# Altium schematic sheet hmi.SchDoc
size 594 x 420 mm; Address1: Address1; Address2: Address2; Address3: Address3; Address4: Address4; DocumentNumber: АБВГ.123456.001 Э3; SheetNumber: 1; Scale: 1:1; DocumentType: Схема электрическая принципиальная; FirstReferrence: АБВГ.123456.001
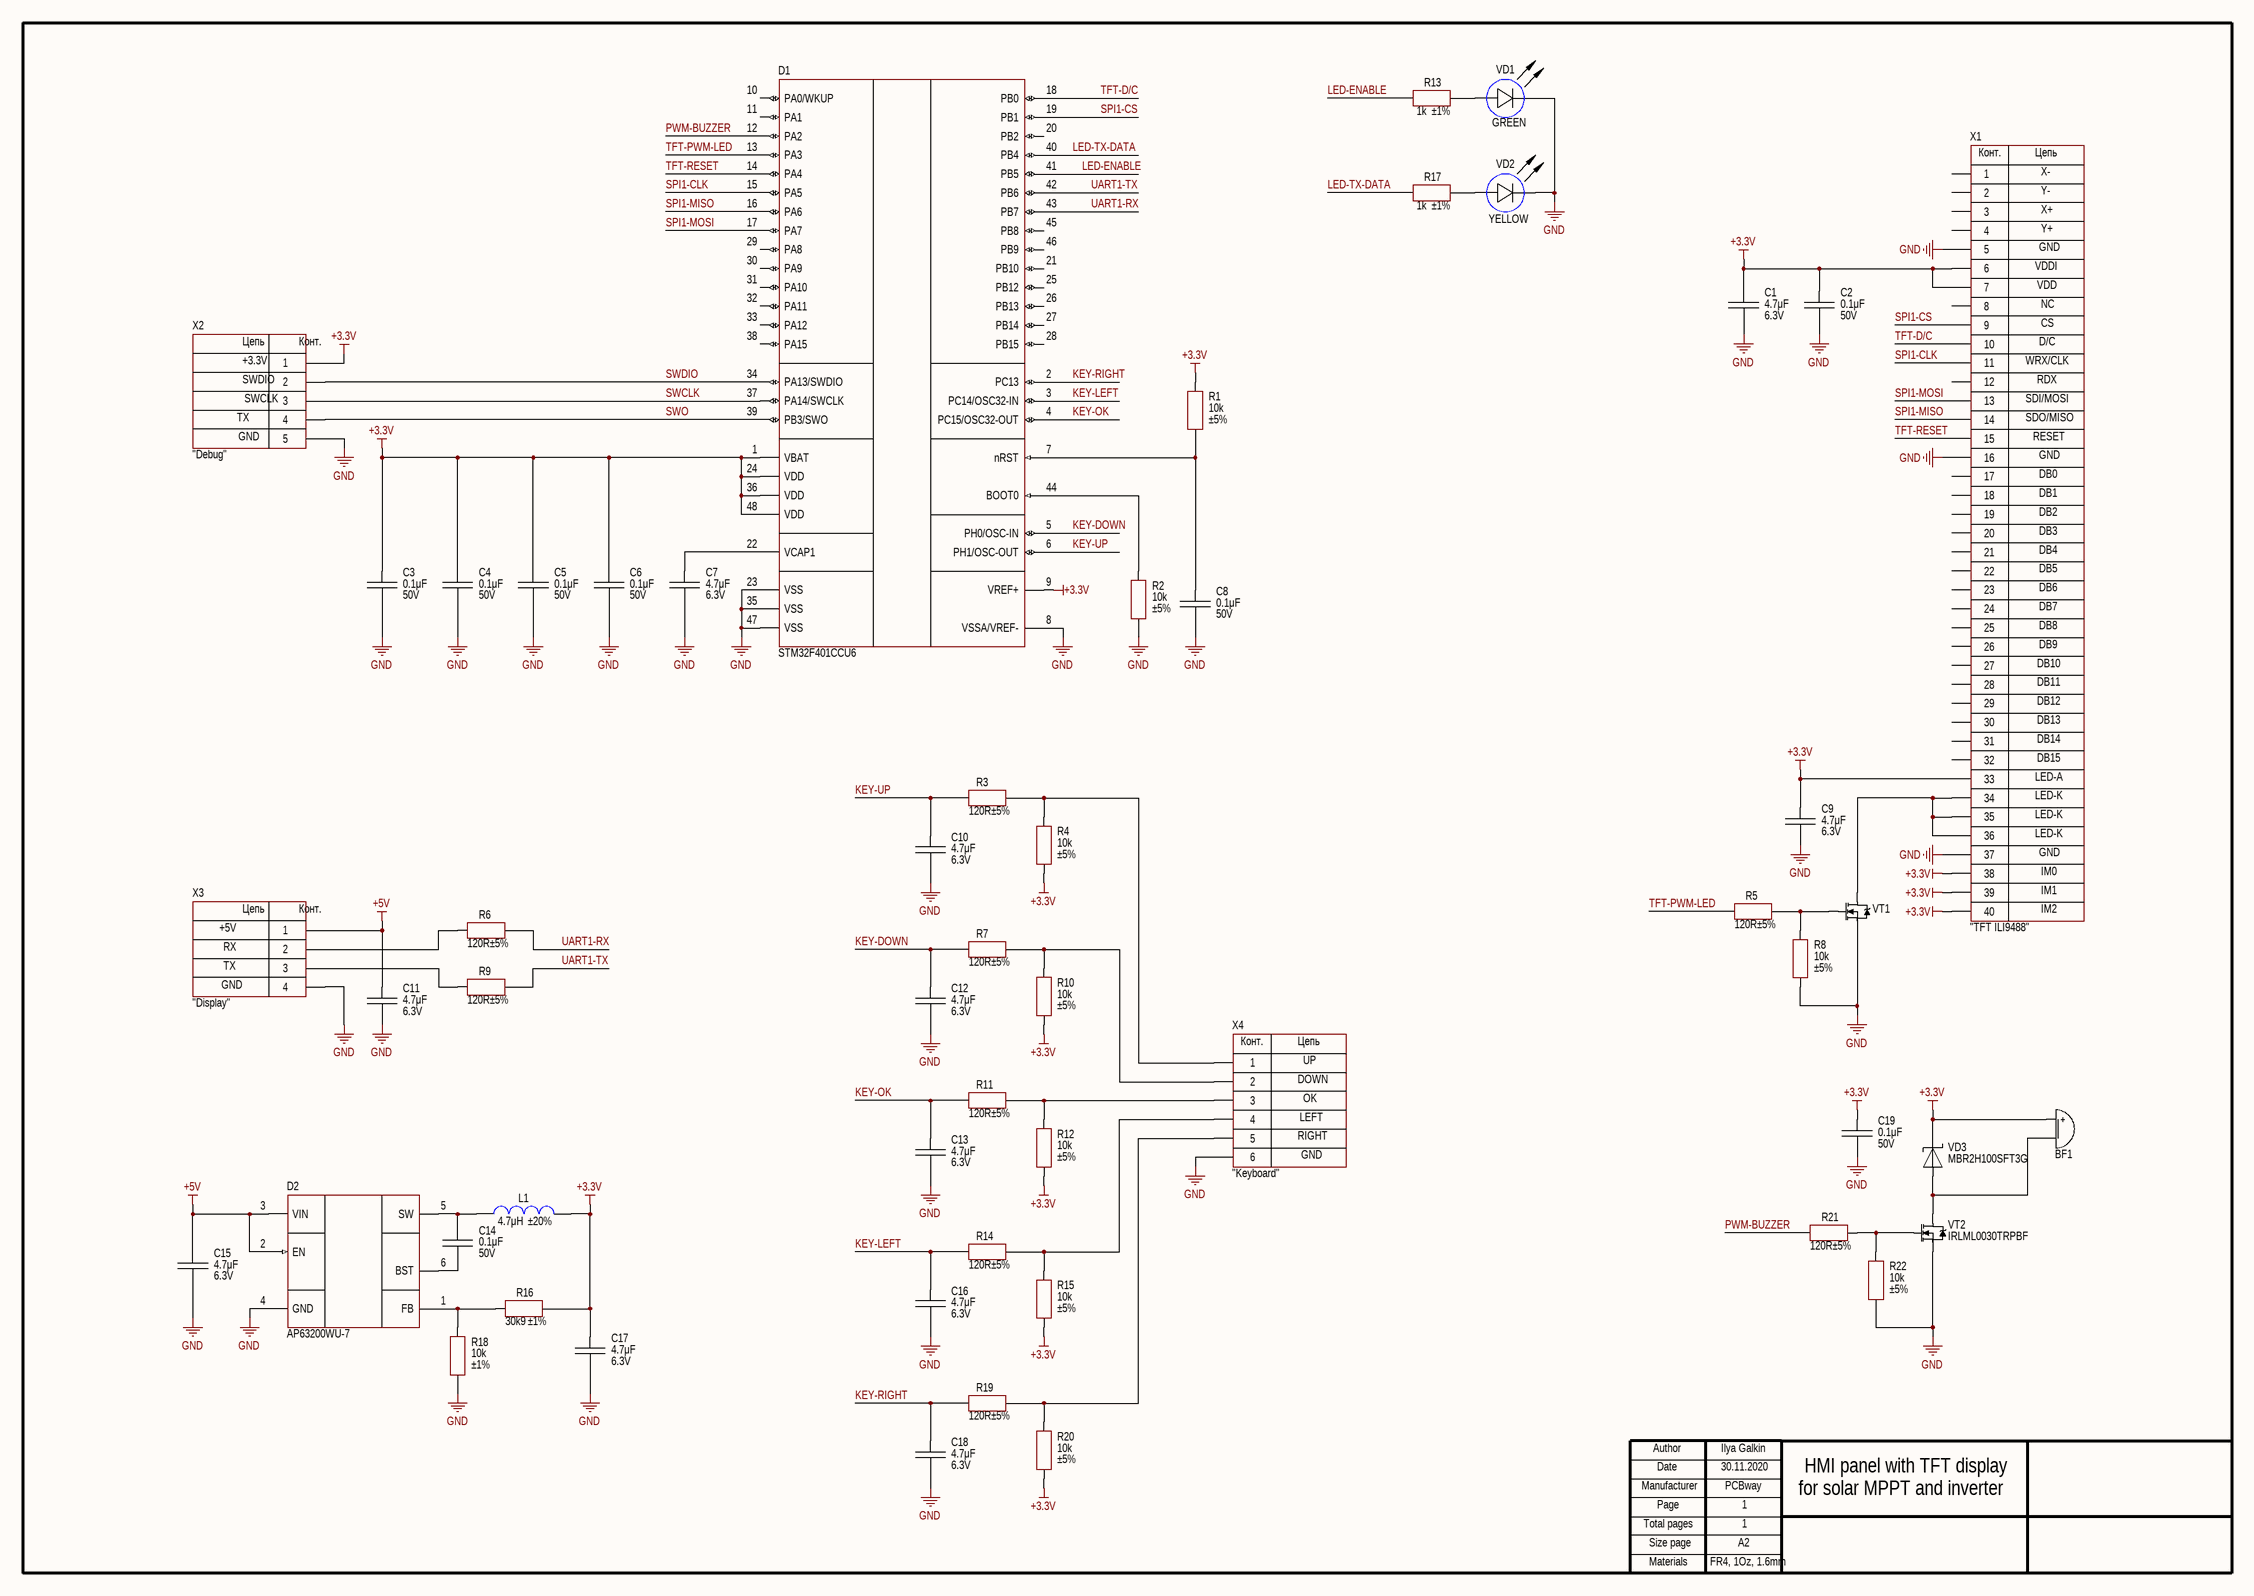
[diagram p0: hmi.SchDoc]

## Parts
BF1  (no value)  [BUZ: CMT-7525]
C1  value 4.7μF  Voltage: 6.3V  [CAP: 0603]
C2  value 0.1μF  Voltage: 50V  [CAP: 0603]
C3  value 0.1μF  Voltage: 50V  [CAP: 0603]
C4  value 0.1μF  Voltage: 50V  [CAP: 0603]
C5  value 0.1μF  Voltage: 50V  [CAP: 0603]
C6  value 0.1μF  Voltage: 50V  [CAP: 0603]
C7  value 4.7μF  Voltage: 6.3V  [CAP: 0603]
C8  value 0.1μF  Voltage: 50V  [CAP: 0603]
C9  value 4.7μF  Voltage: 6.3V  [CAP: 0603]
C10  value 4.7μF  Voltage: 6.3V  [CAP: 0603]
C11  value 4.7μF  Voltage: 6.3V  [CAP: 0603]
C12  value 4.7μF  Voltage: 6.3V  [CAP: 0603]
C13  value 4.7μF  Voltage: 6.3V  [CAP: 0603]
C14  value 0.1μF  Voltage: 50V  [CAP: 0603]
C15  value 4.7μF  Voltage: 6.3V  [CAP: 0603]
C16  value 4.7μF  Voltage: 6.3V  [CAP: 0603]
C17  value 4.7μF  Voltage: 6.3V  [CAP: 0603]
C18  value 4.7μF  Voltage: 6.3V  [CAP: 0603]
C19  value 0.1μF  Voltage: 50V  [CAP: 0603]
D1  (no value)  [48-QFN (7x7)]
D2  (no value)  [SOT23-6]
L1  value 4.7μH  Tolerance: ±20%  [IND: CD32]
R1  value 10k  Tolerance: ±5%  [RES: 0603]
R2  value 10k  Tolerance: ±5%  [RES: 0603]
R3  value 120R  Tolerance: ±5%  [RES: 0603]
R4  value 10k  Tolerance: ±5%  [RES: 0603]
R5  value 120R  Tolerance: ±5%  [RES: 0603]
R6  value 120R  Tolerance: ±5%  [RES: 0603]
R7  value 120R  Tolerance: ±5%  [RES: 0603]
R8  value 10k  Tolerance: ±5%  [RES: 0603]
R9  value 120R  Tolerance: ±5%  [RES: 0603]
R10  value 10k  Tolerance: ±5%  [RES: 0603]
R11  value 120R  Tolerance: ±5%  [RES: 0603]
R12  value 10k  Tolerance: ±5%  [RES: 0603]
R13  value 1k  Tolerance: ±1%  [RES: 0603]
R14  value 120R  Tolerance: ±5%  [RES: 0603]
R15  value 10k  Tolerance: ±5%  [RES: 0603]
R16  value 30k9  Tolerance: ±1%  [RES: 0603]
R17  value 1k  Tolerance: ±1%  [RES: 0603]
R18  value 10k  Tolerance: ±1%  [RES: 0603]
R19  value 120R  Tolerance: ±5%  [RES: 0603]
R20  value 10k  Tolerance: ±5%  [RES: 0603]
R21  value 120R  Tolerance: ±5%  [RES: 0603]
R22  value 10k  Tolerance: ±5%  [RES: 0603]
VD1  Color: GREEN  [LED: 0603G]
VD2  Color: YELLOW  [LED: 0603Y]
VD3  PartNumber: MBR2H100SFT3G  [DIODE: SOD123F]
VT1  (no value)  [SOT23]
VT2  PartNumber: IRLML0030TRPBF  [SOT23]
X1  CommentText: "TFT ILI9488"  [CON: FFC/FPC-40-0.5]
X2  CommentText: "Debug"  [CON: PLS-5]
X3  CommentText: "Display"  [CON: CWF-4R]
X4  CommentText: "Keyboard"  [CON: CWF-6R]

## Nets
+3.3V: BF1.1(+) C1.2 C2.2 C3.2 C4.2 C5.2 C6.2 C9.2 C17.2 C19.2 D1.1(VBAT) D1.9(VREF+) D1.24(VDD) D1.36(VDD) D1.48(VDD) L1.1 R1.2 R4.1 R10.1 R12.1 R15.1 R16.1 R20.1 VD3.2 X1.6 X1.7 X1.33 X1.38 X1.39 X1.40 X2.1
+5V: C11.2 C15.2 D2.2(EN) D2.3(VIN) X3.1
GND: C1.1 C2.1 C3.1 C4.1 C5.1 C6.1 C7.1 C8.1 C9.1 C10.1 C11.1 C12.1 C13.1 C15.1 C16.1 C17.1 C18.1 C19.1 D1.8(VSSA/VREF-) D1.23(VSS) D1.35(VSS) D1.47(VSS) D2.4(GND) R2.1 R8.1 R18.1 R22.1 VD1.2(C) VD2.2(C) VT1.2(S) VT2.2(S) X1.5 X1.16 X1.37 X2.5 X3.4 X4.6
KEY-DOWN: C12.2 D1.5(PH0/OSC-IN) R7.1
KEY-LEFT: C16.2 D1.3(PC14/OSC32-IN) R14.1
KEY-OK: C13.2 D1.4(PC15/OSC32-OUT) R11.1
KEY-RIGHT: C18.2 D1.2(PC13) R19.1
KEY-UP: C10.2 D1.6(PH1/OSC-OUT) R3.1
LED-ENABLE: D1.41(PB5) R13.2
LED-TX-DATA: D1.40(PB4) R17.2
PWM-BUZZER: D1.12(PA2) R21.1
SPI1-CLK: D1.15(PA5) X1.11
SPI1-CS: D1.19(PB1) X1.9
SPI1-MISO: D1.16(PA6) X1.14
SPI1-MOSI: D1.17(PA7) X1.13
SWCLK: D1.37(PA14/SWCLK) X2.3
SWDIO: D1.34(PA13/SWDIO) X2.2
SWO: D1.39(PB3/SWO) X2.4
TFT-D/C: D1.18(PB0) X1.10
TFT-PWM-LED: D1.13(PA3) R5.1
TFT-RESET: D1.14(PA4) X1.15
UART1-RX: D1.43(PB7) R6.2
UART1-TX: D1.42(PB6) R9.2
NetBF1_2: BF1.2(-) VD3.1 VT2.3(D)
NetC7_2: C7.2 D1.22(VCAP1)
NetC8_2: C8.2 D1.7(nRST) R1.1
NetC14_1: C14.1 D2.6(BST)
NetC14_2: C14.2 D2.5(SW) L1.2
NetD1_44: D1.44(BOOT0) R2.2
NetD2_1: D2.1(FB) R16.2 R18.2
NetR3_2: R3.2 R4.2 X4.1
NetR5_2: R5.2 R8.2 VT1.1(G)
NetR6_1: R6.1 X3.2
NetR7_2: R7.2 R10.2 X4.2
NetR9_1: R9.1 X3.3
NetR11_2: R11.2 R12.2 X4.3
NetR13_1: R13.1 VD1.1(A)
NetR14_2: R14.2 R15.2 X4.4
NetR17_1: R17.1 VD2.1(A)
NetR19_2: R19.2 R20.2 X4.5
NetR21_2: R21.2 R22.2 VT2.1(G)
NetVT1_3: VT1.3(D) X1.34 X1.35 X1.36

Not connected (* = marked no-connect by the designer): D1 10(PA0/WKUP) 11(PA1) 20(PB2) 21(PB10) 25(PB12) 26(PB13) 27(PB14) 28(PB15) 29(PA8) 30(PA9) 31(PA10) 32(PA11) 33(PA12) 38(PA15) 45(PB8) 46(PB9); X1 1 2 3 4 8 12 17 18 19 20 21 22 23 24 25 26 27 28 29 30 31 32

## Notes on the sheet
- X-
- Y-
- X+
- GND
- Y+
- VDDI
- VDD
- NC
- D/C
- CS
- SWDIO
- +3.3V
- SWCLK
- WRX/CLK
- SDI/MOSI
- RDX
- TX
- SDO/MISO
- RESET
- DB0
- DB1
- DB2
- DB3
- DB4
- DB5
- DB6
- DB7
- DB8
- DB9
- DB10
- DB11
- DB12
- DB13
- DB14
- LED-A
- DB15
- LED-K
- IM0
- +5V
- IM1
- IM2
- RX
- DOWN
- UP
- LEFT
- OK
- RIGHT
- Ilya Galkin
- 30.11.2020
- PCBway
- 1
- for solar MPPT and inverter
- HMI panel with TFT display
- FR4, 1Oz, 1.6mm
- Author
- Manufacturer
- Date
- Page
- Total pages
- Size page
- A2
- Materials
- (in symbol Connector_FFC_40) Конт.; Цепь
- (in symbol CWF-4) Цепь; Конт.
- (in symbol CWF-6) Конт.; Цепь
- (in symbol PLS-5) Цепь; Конт.

## Library data of the parts
BF1 = Buzzer: Manufacturer: Jiangsu; ValueManufacturerPartNumber: SMD, 7.5x7.5x2.5 mm, 2.7 kHz, 3.6VDC, 80dB, -20...+70°C; TypeBuzzer: SMD, 7.5x7.5x2.5 mm; VoltageMax: 3.6VDC; Frequency: 2.7 kHz; CurrentMax: 80dB; HelpURL: https://lcsc.com/product-detail/Buzzers_Jiangsu-Huaneng-Elec-MLT-7525_C95299.html; PartNumber: MLT-7525; Temperature: -20...+70°C
C1 C7 C9-C13 C15-C18 = Ceramic_0603: Manufacturer: Samsung; PartNumber: CL10B475KQ8NQNC; ValueManufacturerPartNumber: Ceramic capacitor, 4.7μF, X7R, ±10%, 6.3V, 0603, -55...+125°C; TypeCapacitor: Ceramic capacitor; Tolerance: ±10%; TypeDielectric: X7R; Package: 0603; HelpURL: https://www.digikey.com/en/products/detail/samsung-electro-mechanics/CL10B475KQ8NQNC/3887745; Temperature: -55...+125°C
C2-C6 C8 C14 C19 = Ceramic_0603: Manufacturer: Samsung; PartNumber: CL10B104KB8WPND; ValueManufacturerPartNumber: Ceramic capacitor, 0.1μF, X7R, ±10%, 50V, 0603, -55...+125°C; TypeCapacitor: Ceramic capacitor; Tolerance: ±10%; TypeDielectric: X7R; Package: 0603; HelpURL: https://www.digikey.com/product-detail/en/samsung-electro-mechanics/CL10B104KB8WPND/1276-CL10B104KB8WPNDCT-ND/11488014; Temperature: -55...+125°C
D1 = STM32F401CCU6: Cortex-M4; Manufacturer: STMicroelectronics; ValueManufacturerPartNumber: IC microcontroller, 32-Bit, Cortex-M4, 84MHz, 256KB, 64KB, 1.7...3.6V, -40...+85°C, 48-UFQFPN (7x7); Supply: 1.7...3.6V; Speed: 84MHz; CoreSize: 32-Bit; MemoryROM: 256KB; MemoryRAM: 64KB; HelpURL: https://www.digikey.com/en/products/detail/stmicroelectronics/STM32F401CCU6/4755971; Package: 48-UFQFPN (7x7); ComponentType: IC microcontroller; Temperature: -40...+85°C; CoreProcessor: Cortex-M4; PartNumber: STM32F401CCU6
D2 = AP63200WU-7: Buck converter; Manufacturer: Diodes; ValueManufacturerPartNumber: DC/DC buck converter, input 3.8...32V, 500kHz, output 1.2...12V, 2A, -40...+85°C, SOT23-6; VoltageInput: input 3.8...32V; Frequency: 500kHz; CurrentOutput: 2A; VoltageOutput: output 1.2...12V; HelpURL: https://www.digikey.com/en/products/detail/diodes-incorporated/AP63200WU-7/9858423; Package: SOT23-6; ComponentType: DC/DC buck converter; Temperature: -40...+85°C; PartNumber: AP63200WU-7
L1 = Inductor_CD32: Manufacturer: YJYCOIN; PartNumber: CD32YP0302-4R7M; ValueManufacturerPartNumber: Fixed inductor, 4.7μH, ±20%, CD32 series, 1.5A, -40...+125°C; TypeInductor: Fixed inductor; MaxCurrent: 1.5A; Package: CD32 series; HelpURL: https://lcsc.com/product-detail/New-Arrivals_YJYCOIN-CD32YP0302-4R7M_C492259.html; Temperature: -40...+125°C
R1 R2 R4 R8 R10 R12 R15 R20 R22 = Resistor_0603: Manufacturer: Yageo; PartNumber: RC0603JR-0710KL; ValueManufacturerPartNumber: Resistor film, 10k, ±5%, 0603, 0.1W, -55...+125°C; TypeResistor: Resistor film; Power: 0.1W; Package: 0603; HelpURL: https://www.digikey.com/product-detail/en/yageo/RC0603JR-0710KL/311-10KGRCT-ND/729647; Temperature: -55...+125°C
R3 R5-R7 R9 R11 R14 R19 R21 = Resistor_0603: Manufacturer: Yageo; PartNumber: RC0603JR-07120RL; ValueManufacturerPartNumber: Resistor film, 120R, ±5%, 0603, 0.1W, -55...+125°C; TypeResistor: Resistor film; Power: 0.1W; Package: 0603; HelpURL: https://www.digikey.com/product-detail/en/yageo/RC0603JR-07120RL/311-120GRCT-ND/729653; Temperature: -55...+125°C
R13 R17 = Resistor_0603: Manufacturer: Yageo; PartNumber: RC0603JR-071KL; ValueManufacturerPartNumber: Resistor film, 1k, ±1%, 0603, 0.1W, -55...+125°C; TypeResistor: Resistor film; Power: 0.1W; Package: 0603; HelpURL: https://www.digikey.com/en/products/detail/yageo/RC0603JR-071KL/726677?s=N4IgTCBcDaIEoGEAMA2JBmAUnAtEg7AIwDSAMiALoC%2BQA; Temperature: -55...+125°C
R16 = Resistor_0603: Manufacturer: Yageo; PartNumber: RC0603FR-0730K9L; ValueManufacturerPartNumber: Resistor film, 30k9, ±1%, 0603, 0.1W, -55...+125°C; TypeResistor: Resistor film; Power: 0.1W; Package: 0603; HelpURL: https://www.digikey.com/en/products/detail/yageo/RC0603FR-0730K9L/727144; Temperature: -55...+125°C
R18 = Resistor_0603: Manufacturer: Yageo; PartNumber: AC0603FR-0710KL; ValueManufacturerPartNumber: Resistor film, 10k, ±1%, 0603, 0.1W, -55...+125°C; TypeResistor: Resistor film; Power: 0.1W; Package: 0603; HelpURL: https://www.digikey.com/en/products/detail/yageo/AC0603FR-0710KL/2827814; Temperature: -55...+125°C
VD1 = LED_single: Manufacturer: Wurth; ValueManufacturerPartNumber: LED, 20mA, 2V, 0603, -55...+150°C; PartNumber: 150060VS75000; TypeDiode: LED; Current: 20mA; VoltageDrop: 2V; Package: 0603; HelpURL: https://www.digikey.com/product-detail/en/w-rth-elektronik/150060VS75000/732-4980-1-ND/4489904; Temperature: -55...+150°C
VD2 = LED_single: Manufacturer: Wurth; ValueManufacturerPartNumber: LED, 20mA, 2V, 0603, -55...+150°C; PartNumber: 150060YS75000; TypeDiode: LED; Current: 20mA; VoltageDrop: 2V; Package: 0603; HelpURL: https://www.digikey.com/product-detail/en/wurth-electronics-inc/150060YS75000/732-4981-1-ND/4489907; Temperature: -55...+150°C
VD3 = Schottky_single: Manufacturer: ON Semiconductor; ValueManufacturerPartNumber: Schottky diode, 100V, 2A, 840mV, 15pF, SOD-123F, -55...+150°C; TypeDiode: Schottky diode; Voltage: 100V; Current: 2A; VoltageDrop: 840mV; RecoveryTime: 15pF; Package: SOD-123F; HelpURL: https://www.digikey.com/product-detail/en/on-semiconductor/MBR2H100SFT3G/MBR2H100SFT3GOSCT-ND/3462288; Temperature: -55...+150°C
VT1 = MOSFET_N_132: Manufacturer: Infineon Technologies; ValueManufacturerPartNumber: MOSFET N-channel transistor, 30V, 5.3A, 2.6nC, 1.3W, 27mOhm, 382pF, SOT-23, -55...+150°C; PartNumber: IRLML0030TRPBF; TypeTransistor: MOSFET N-channel transistor; VoltageDS: 30V; CurrentDS: 5.3A; RDS: 27mOhm; GateCharge: 2.6nC; InputCapacitor: 382pF; MaxPower: 1.3W; Package: SOT-23; HelpURL: https://www.digikey.com/en/products/detail/infineon-technologies/IRLML0030TRPBF/2202215?s=N4IgTCBcDaIJICUAyBZJAGdBmdIC6AvkA; Temperature: -55...+150°C
VT2 = MOSFET_N_132: Manufacturer: Infineon Technologies; ValueManufacturerPartNumber: MOSFET N-channel transistor, 30V, 5.3A, 2.6nC, 1.3W, 27mOhm, 382pF, SOT-23, -55...+150°C; TypeTransistor: MOSFET N-channel transistor; VoltageDS: 30V; CurrentDS: 5.3A; RDS: 27mOhm; GateCharge: 2.6nC; InputCapacitor: 382pF; MaxPower: 1.3W; Package: SOT-23; HelpURL: https://www.digikey.com/en/products/detail/infineon-technologies/IRLML0030TRPBF/2202215?s=N4IgTCBcDaIJICUAyBZJAGdBmdIC6AvkA; Temperature: -55...+150°C
X1 = Connector_FFC_40: Manufacturer: JUSHUO; ValueManufacturerPartNumber: Connector, 40pin, 0.5mm, FFC/FPC, Top contact; PartNumber: AFC07-S40ECC-00; VoltageMax: FFC/FPC; Pitch: 0.5mm; CurrentMax: Top contact; Multichannel: 40pin; HelpURL: https://lcsc.com/product-detail/FFC-FPC-Connectors_JUSHUO-AFC07-S40ECC-00_C11097.html; TypeConnector: Connector
X2 = PLS-5: Manufacturer: Connfly; ValueManufacturerPartNumber: Connector, 5pin, 2.54mm, 500VAC, 3A; TypeConnector: Connector; VoltageMax: 500VAC; Pitch: 2.54mm; CurrentMax: 3A; Multichannel: 5pin; HelpURL: https://www.chipdip.ru/product/pls-5; PartNumber: PLS-5
X3 = CWF-4: Manufacturer: Connfly; ValueManufacturerPartNumber: Connector, 4pin, 2.54mm, 250VAC, 3A; PartNumber: CWF-4R; TypeConnector: Connector; VoltageMax: 250VAC; Pitch: 2.54mm; CurrentMax: 3A; Multichannel: 4pin; HelpURL: https://www.chipdip.ru/product/cwf-4r-ds1069-4-mr
X4 = CWF-6: Manufacturer: Connfly; ValueManufacturerPartNumber: Connector, 6pin, 2.54mm, 250VAC, 3A; PartNumber: CWF-6R; TypeConnector: Connector; VoltageMax: 250VAC; Pitch: 2.54mm; CurrentMax: 3A; Multichannel: 6pin; HelpURL: https://www.chipdip.ru/product/cwf-6r-ds1069-6-mr